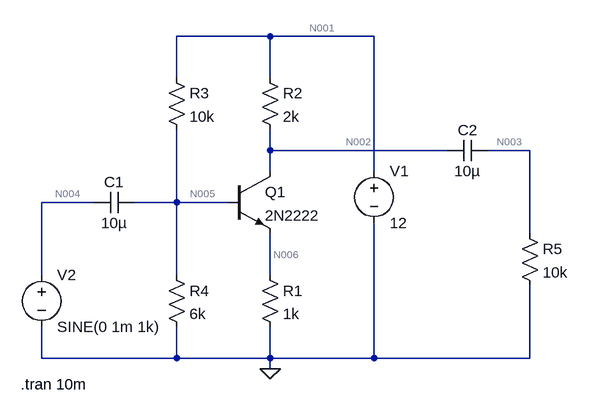
[diagram p0: schematic progress.asc]
progress.asc, the LTspice schematic file:
Version 4.1
SHEET 1 880 680
WIRE 272 -80 128 -80
WIRE 432 -80 272 -80
WIRE 128 -16 128 -80
WIRE 272 -16 272 -80
WIRE 272 96 272 64
WIRE 544 96 272 96
WIRE 672 96 608 96
WIRE 272 128 272 96
WIRE 432 128 432 -80
WIRE 0 176 -80 176
WIRE 128 176 128 64
WIRE 128 176 64 176
WIRE 208 176 128 176
WIRE 672 224 672 96
WIRE -80 288 -80 176
WIRE 128 288 128 176
WIRE 272 288 272 224
WIRE -80 416 -80 368
WIRE 128 416 128 368
WIRE 128 416 -80 416
WIRE 272 416 272 368
WIRE 272 416 128 416
WIRE 432 416 432 208
WIRE 432 416 272 416
WIRE 672 416 672 304
WIRE 672 416 432 416
WIRE 272 432 272 416
FLAG 272 432 0
SYMBOL npn 208 128 R0
SYMATTR InstName Q1
SYMATTR Value 2N2222
SYMBOL res 256 272 R0
SYMATTR InstName R1
SYMATTR Value 1k
SYMBOL res 256 -32 R0
SYMATTR InstName R2
SYMATTR Value 2k
SYMBOL voltage 432 112 R0
WINDOW 123 0 0 Left 0
WINDOW 39 0 0 Left 0
SYMATTR InstName V1
SYMATTR Value 12
SYMBOL res 112 -32 R0
SYMATTR InstName R3
SYMATTR Value 10k
SYMBOL res 112 272 R0
SYMATTR InstName R4
SYMATTR Value 6k
SYMBOL cap 64 160 R90
WINDOW 0 0 32 VBottom 2
WINDOW 3 32 32 VTop 2
SYMATTR InstName C1
SYMATTR Value 10µ
SYMBOL voltage -80 272 R0
WINDOW 123 0 0 Left 0
WINDOW 39 0 0 Left 0
SYMATTR InstName V2
SYMATTR Value SINE(0 1m 1k)
SYMBOL cap 608 80 R90
WINDOW 0 0 32 VBottom 2
WINDOW 3 32 32 VTop 2
SYMATTR InstName C2
SYMATTR Value 10µ
SYMBOL res 656 208 R0
SYMATTR InstName R5
SYMATTR Value 10k
TEXT -112 456 Left 2 !.tran 10m

The netlist it stands for:
* progress.asc
Q1 N002 N005 N006 0 2N2222
R1 N006 0 1k
R2 N001 N002 2k
V1 N001 0 12
R3 N001 N005 10k
R4 N005 0 6k
C1 N005 N004 10µ
V2 N004 0 SINE(0 1m 1k)
C2 N003 N002 10µ
R5 N003 0 10k
.model NPN NPN
.model PNP PNP
.lib standard.bjt
.tran 10m
.backanno
.end

* Results of the author's LTspice run, read from the files saved beside the schematic
* Operating Point, zero values left out:
*   V(n005) = 4.429 V
*   V(n001) = 12 V
*   V(n002) = 4.559 V
*   V(n006) = 3.739 V
*   Ic(Q1) = 3.72 mA
*   Ib(Q1) = 18.81 µA
*   Ie(Q1) = -3.739 mA
*   I(R2) = 3.72 mA
*   I(R3) = 757.1 µA
*   I(R4) = 738.2 µA
*   I(V1) = -4.477 mA
*   I(R1) = 3.739 mA
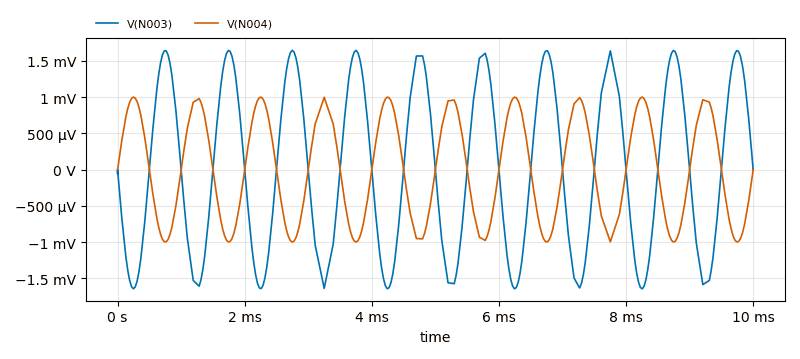
[diagram p1: Transient Analysis of progress.asc, plotted from the saved traces]
* Transient Analysis, 1 run:
*   V(N003): min -1.644 mV, max 1.644 mV, average 952.6 nV, rms 1.16 mV, last -10.21 µV
*   V(N004): min -999.8 µV, max 999.8 µV, average -876.1 nV, rms 705.7 µV, last 0 V